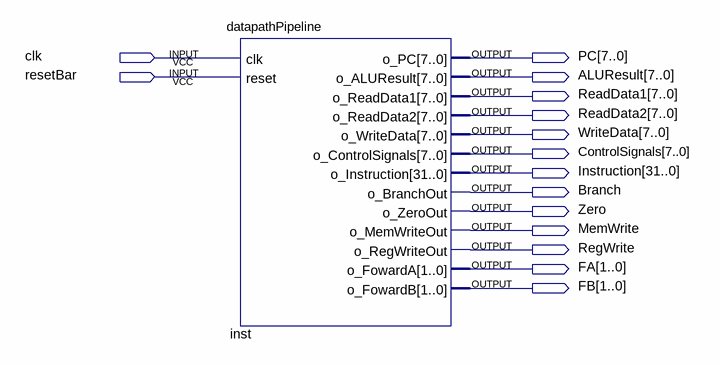
[diagram p0: schematic sheet]
// Quartus schematic 3156lab3.bdf as structural Verilog: 1 symbols, 15 pins
module \3156lab3  (
  input  clk,
  input  resetBar,
  output [7:0] PC,
  output [7:0] ALUResult,
  output [7:0] ReadData1,
  output [7:0] ReadData2,
  output [7:0] WriteData,
  output [7:0] ControlSignals,
  output [31:0] Instruction,
  output Branch,
  output Zero,
  output MemWrite,
  output RegWrite,
  output [1:0] FA,
  output [1:0] FB
);

  datapathPipeline inst (
    .clk(clk), .reset(resetBar), .o_PC(PC), .o_ALUResult(ALUResult), .o_ReadData1(ReadData1),
    .o_ReadData2(ReadData2), .o_WriteData(WriteData), .o_ControlSignals(ControlSignals),
    .o_Instruction(Instruction), .o_BranchOut(Branch), .o_ZeroOut(Zero), .o_MemWriteOut(MemWrite),
    .o_RegWriteOut(RegWrite), .o_FowardA(FA), .o_FowardB(FB));
endmodule
